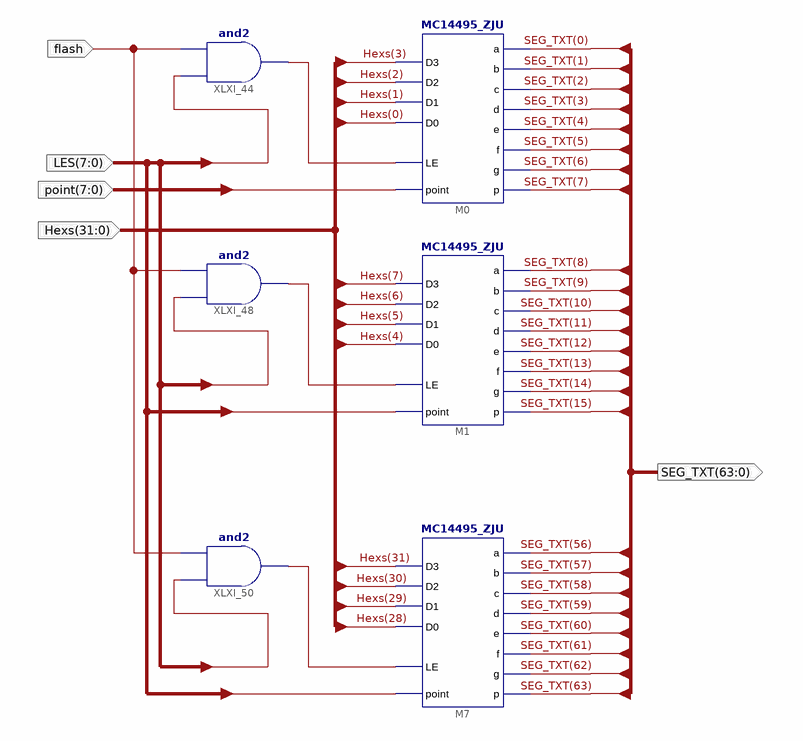
[diagram p0: schematic sheet 1]
// Xilinx ISE schematic SHexTo8SEG.sch (kintex7) as structural Verilog: 6 symbols, 5 ports
module SHexTo8SEG (
  input  flash,
  input  [31:0] Hexs,
  input  [7:0] LES,
  input  [7:0] point,
  output [63:0] SEG_TXT
);

  wire XLXN_271, XLXN_382, XLXN_385, XLXN_434, XLXN_435, XLXN_436, XLXN_454, XLXN_455, XLXN_456;

  MC14495_ZJU M0 (
    .D0(Hexs[0]), .D1(Hexs[1]), .D2(Hexs[2]), .D3(Hexs[3]), .p(SEG_TXT[7]), .g(SEG_TXT[6]), .f(SEG_TXT[5]),
    .e(SEG_TXT[4]), .d(SEG_TXT[3]), .c(SEG_TXT[2]), .b(SEG_TXT[1]), .a(SEG_TXT[0]), .point(XLXN_271),
    .LE(XLXN_385));
  and XLXI_44 (XLXN_385, XLXN_382, flash);
  MC14495_ZJU M1 (
    .D0(Hexs[4]), .D1(Hexs[5]), .D2(Hexs[6]), .D3(Hexs[7]), .p(SEG_TXT[15]), .g(SEG_TXT[14]),
    .f(SEG_TXT[13]), .e(SEG_TXT[12]), .d(SEG_TXT[11]), .c(SEG_TXT[10]), .b(SEG_TXT[9]), .a(SEG_TXT[8]),
    .point(XLXN_434), .LE(XLXN_436));
  and XLXI_48 (XLXN_436, XLXN_435, flash);
  MC14495_ZJU M7 (
    .D0(Hexs[28]), .D1(Hexs[29]), .D2(Hexs[30]), .D3(Hexs[31]), .p(SEG_TXT[63]), .g(SEG_TXT[62]),
    .f(SEG_TXT[61]), .e(SEG_TXT[60]), .d(SEG_TXT[59]), .c(SEG_TXT[58]), .b(SEG_TXT[57]), .a(SEG_TXT[56]),
    .point(XLXN_454), .LE(XLXN_456));
  and XLXI_50 (XLXN_456, XLXN_455, flash);
endmodule
